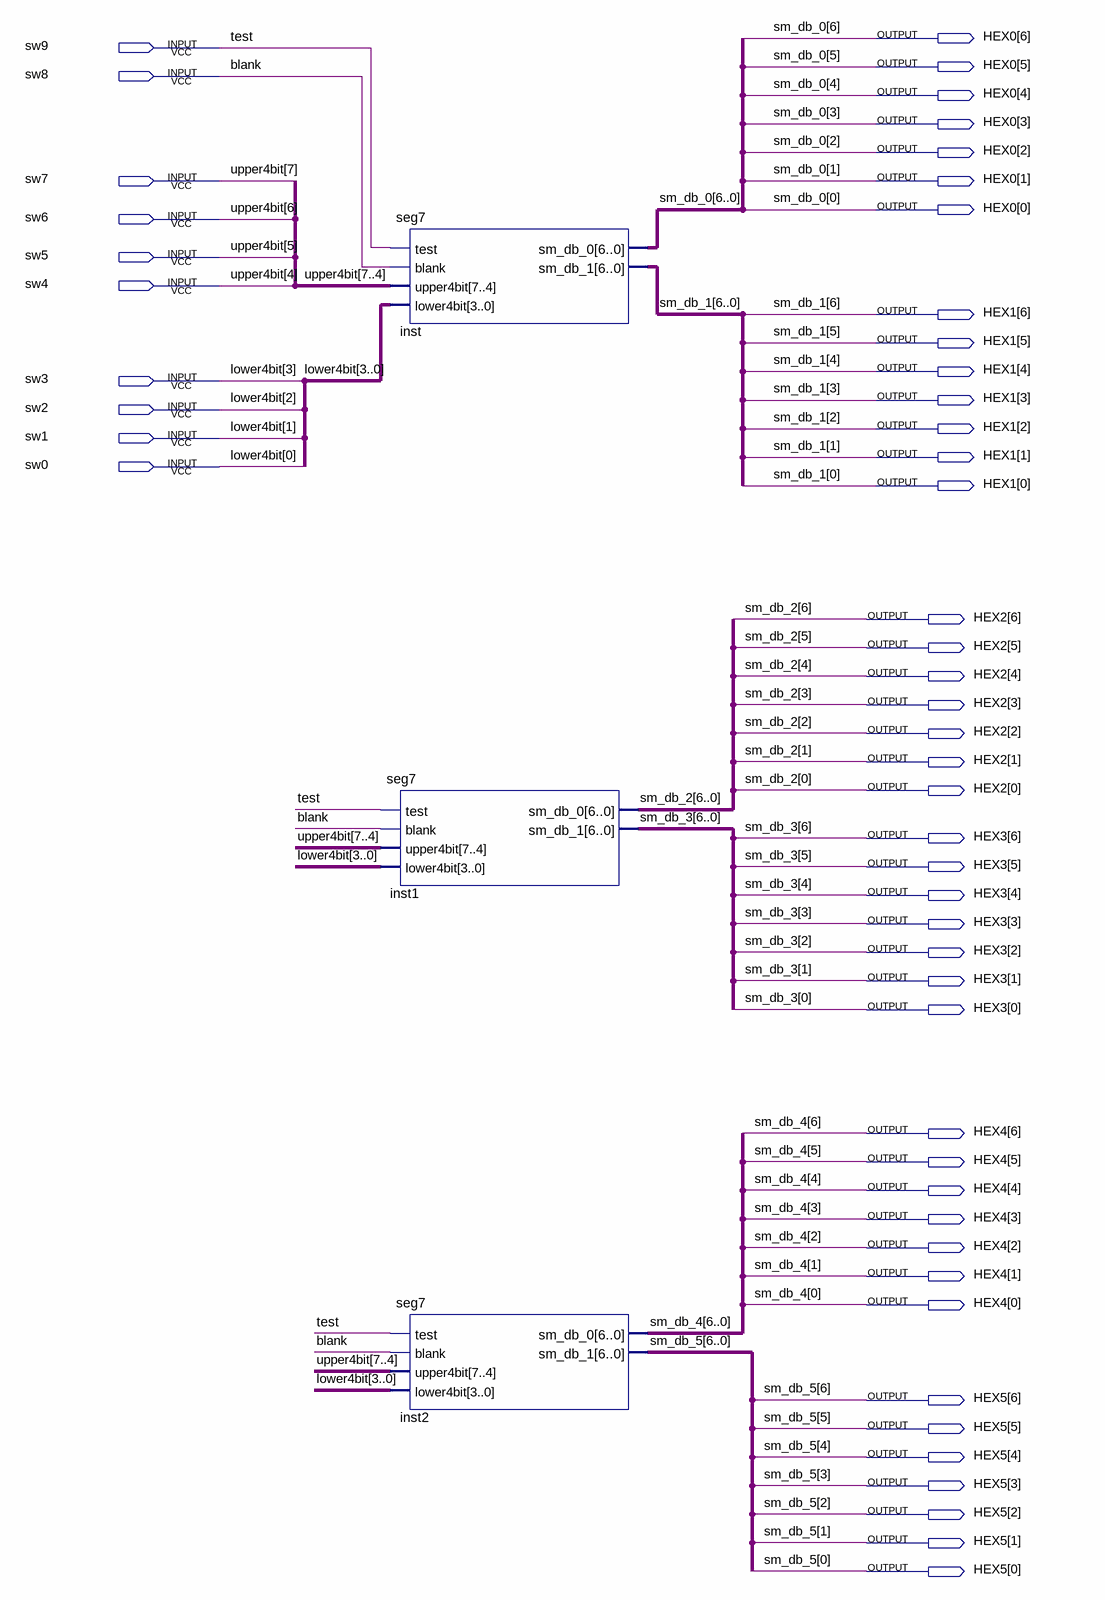
[diagram p0: schematic sheet]
// Quartus schematic seg7_tb.bdf as structural Verilog: 3 symbols, 52 pins
module seg7_tb (
  input  sw9,
  input  sw8,
  input  sw7,
  input  sw6,
  input  sw5,
  input  sw4,
  input  sw3,
  input  sw2,
  input  sw1,
  input  sw0,
  output [6:0] HEX0,
  output [6:0] HEX1,
  output [6:0] HEX2,
  output [6:0] HEX3,
  output [6:0] HEX4,
  output [6:0] HEX5
);

  seg7 inst (
    .test(sw9), .blank(sw8), .upper4bit({sw7, sw6, sw5, sw4}), .lower4bit({sw3, sw2, sw1, sw0}),
    .sm_db_0(HEX0), .sm_db_1(HEX1));
  seg7 inst1 (
    .test(sw9), .blank(sw8), .upper4bit({sw7, sw6, sw5, sw4}), .lower4bit({sw3, sw2, sw1, sw0}),
    .sm_db_0(HEX2), .sm_db_1(HEX3));
  seg7 inst2 (
    .test(sw9), .blank(sw8), .upper4bit({sw7, sw6, sw5, sw4}), .lower4bit({sw3, sw2, sw1, sw0}),
    .sm_db_0(HEX4), .sm_db_1(HEX5));

  // Other names for the same wires on the sheet: blank = sw8; lower4bit[3:0] = {sw3, sw2, sw1, sw0};
  //   sm_db_0[6:0] = HEX0; sm_db_1[6:0] = HEX1; sm_db_2[6:0] = HEX2; sm_db_3[6:0] = HEX3; sm_db_4[6:0] = HEX4;
  //   sm_db_5[6:0] = HEX5; test = sw9; upper4bit[7:4] = {sw7, sw6, sw5, sw4}
endmodule
